# EAGLE design FanTimer (EAGLE 6.3)
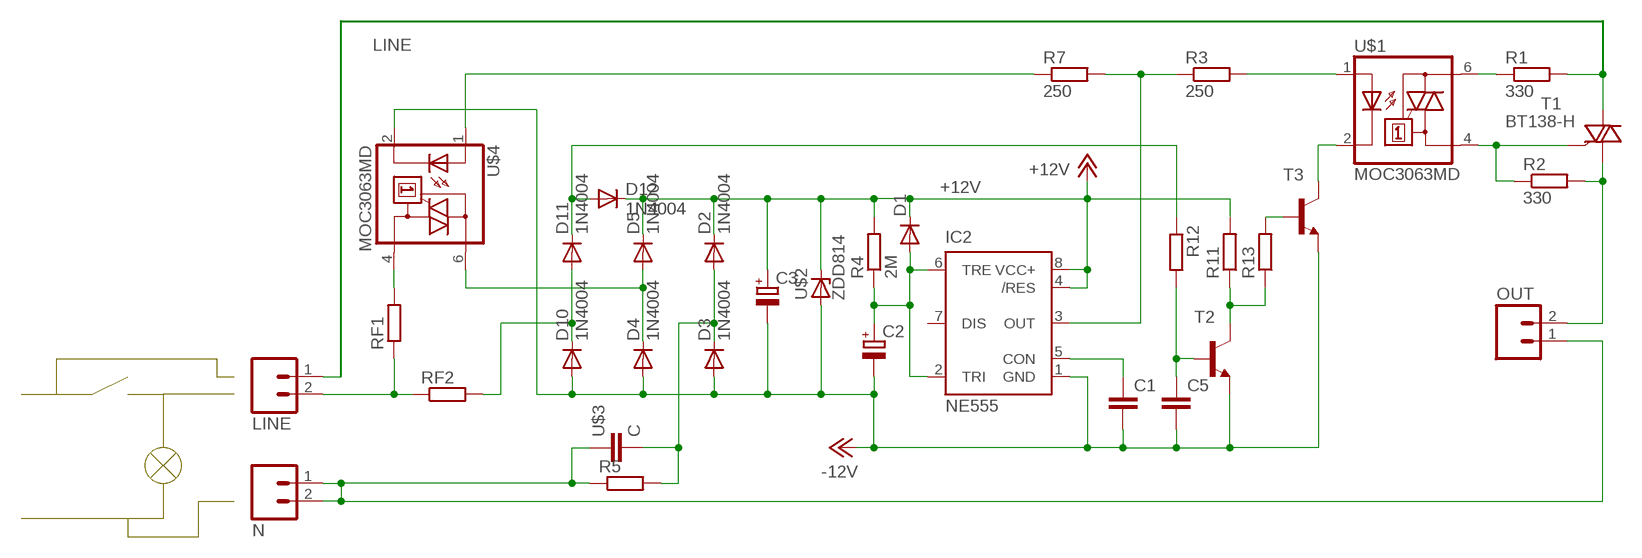
[diagram p0: schematic, sheet 1]

## Parts
C1  C-EU050-025X075  [C050-025X075]
C2  CPOL-EUE2.5-7  [E2,5-7]
C3  CPOL-EUE2.5-7  [E2,5-7]
C5  C-EUC0805  [C0805]
D1  DIODE-SOD80C  [SOD80C]
D2  1N4004  [DO41-10]
D3  1N4004  [DO41-10]
D4  1N4004  [DO41-10]
D5  1N4004  [DO41-10]
D10  1N4004  [DO41-10]
D11  1N4004  [DO41-10]
D12  1N4004  [DO41-10]
IC2  NE555  [DIL-08]
LINE  CON_2P  [CON_PWR_2PIN4MM]
N  CON_2P  [CON_PWR_2PIN4MM]
OUT  CON_2P  [CON_PWR_2PIN4MM]
R1  330  R-EU_0207/10  [0207/10]
R2  330  R-EU_0207/10  [0207/10]
R3  250  R-EU_0207/10  [0207/10]
R4  2M  R-EU_0207/10  [0207/10]
R5  R-EU_0411/12  [0411/12]
R7  250  R-EU_0207/10  [0207/10]
R11  R-EU_0207/10  [0207/10]
R12  R-EU_0207/10  [0207/10]
R13  R-EU_0207/10  [0207/10]
RF1  R-EU_R1206  [R1206]
RF2  R-EU_R1206  [R1206]
T1  BT138-H  [TO220BH]
T2  -NPN-TO92-ECB  [TO92-ECB]
T3  -NPN-TO92-ECB  [TO92-ECB]
U$1  MOC3063MD  [DIL6]
U$2  ZDD814  [ZDMETAL]
U$3  C  [C_22X10]
U$4  MOC3063MD  [DIL6]

## Nets
+12V: C3.+ D1.C D2.C D5.C D12.C IC2.4(/RES) IC2.8(VCC+) R4.2 R11.2 U$2.C
-12V: C1.2 C2.- C3.- C5.2 D3.A D4.A D10.A IC2.1(GND) T2.E T3.E U$2.A U$4.2(C)
LINE: LINE.1 R1.2 T1.T2(A2)
N$1: D4.C D5.A U$4.6(A2)
N$2: RF1.2 U$4.4(A1)
N$3: C1.1 IC2.5(CON)
N$4: R7.1 U$4.1(A)
N$5: R2.1 T1.G U$1.4(A1)
N$6: R1.1 U$1.6(A2)
N$7: D11.C D12.A R12.1
N$8: C2.+ D1.A IC2.2(TRI) IC2.6(TRE) R4.1
N$9: OUT.2 R2.2 T1.T1(A1)
N$12: IC2.3(OUT) R3.1 R7.2
N$13: R3.2 U$1.1(A)
N$14: R11.1 R13.1 T2.C
N$18: LINE.2 RF1.1 RF2.1
N$20: D2.A D3.C R5.2 U$3.2
N$23: R13.2 T3.B
N$24: N.1 N.2 OUT.1 R5.1 U$3.1
N$26: C5.1 R12.2 T2.B
N$28: T3.C U$1.2(C)
SWITCH: D10.C D11.A RF2.2
Unconnected: IC2.7(DIS)

## Library data of the parts
C1 C5 = rcl:C-EU: CAPACITOR, European symbol
C2 C3 = rcl:CPOL-EU: POLARIZED CAPACITOR, European symbol
D1 = diode:DIODE-: DIODE
D2-D5 D10-D12 = diode:1N4004: DIODE general purpose rectifier, 1 A
IC2 = st-microelectronics:NE555: General purpose bipolar Timer; MF: Arrow Electronics; MPN: NE555N; OC_FARNELL: 1467742; OC_NEWARK: 89K1486
LINE N OUT = DSS0:CON_2P
R1-R5 R7 R11-R13 RF1 RF2 = rcl:R-EU_: RESISTOR, European symbol
T1 = triac:BT138: TRIAC Source: http://www.semiconductors.philips.com BT138_SERIES_2.pdf
T2 T3 = transistor:*-NPN-: NPN Transistror BF959 corrected 2008.03.06
U$1 U$4 = DSS0:MOC3063M
U$2 = DSS0:ZD
U$3 = DSS0:C

## Board
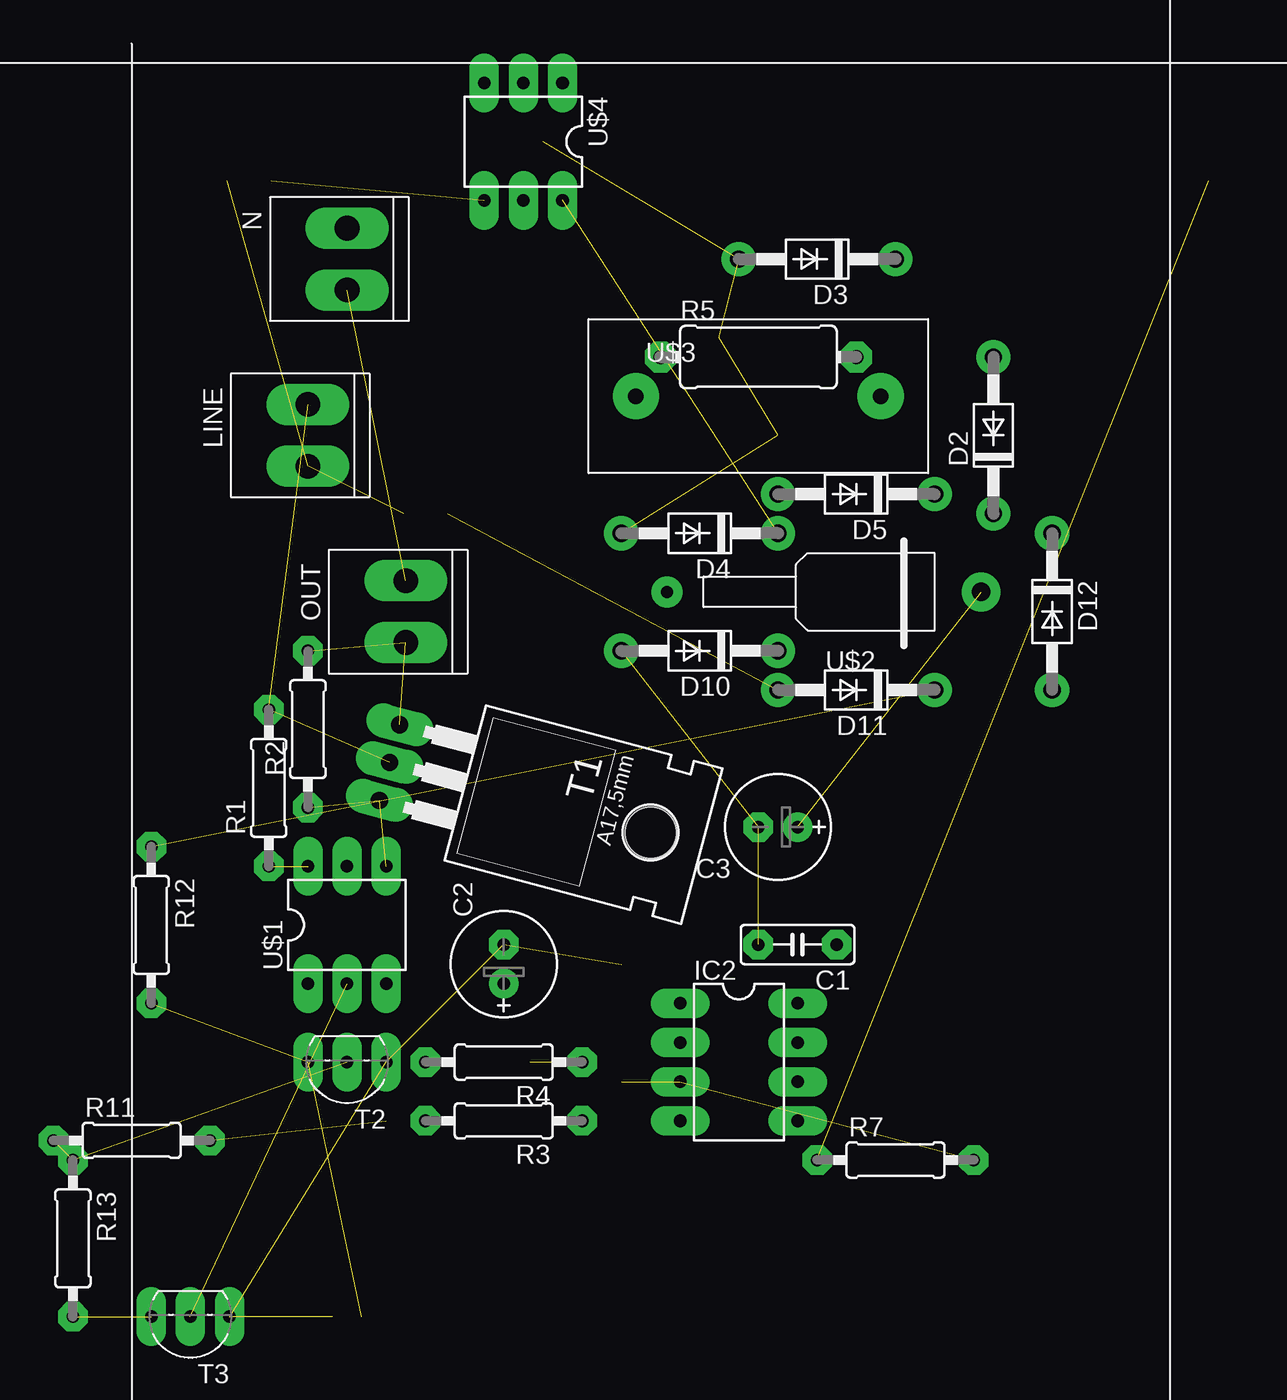
[diagram p1: board, top side]
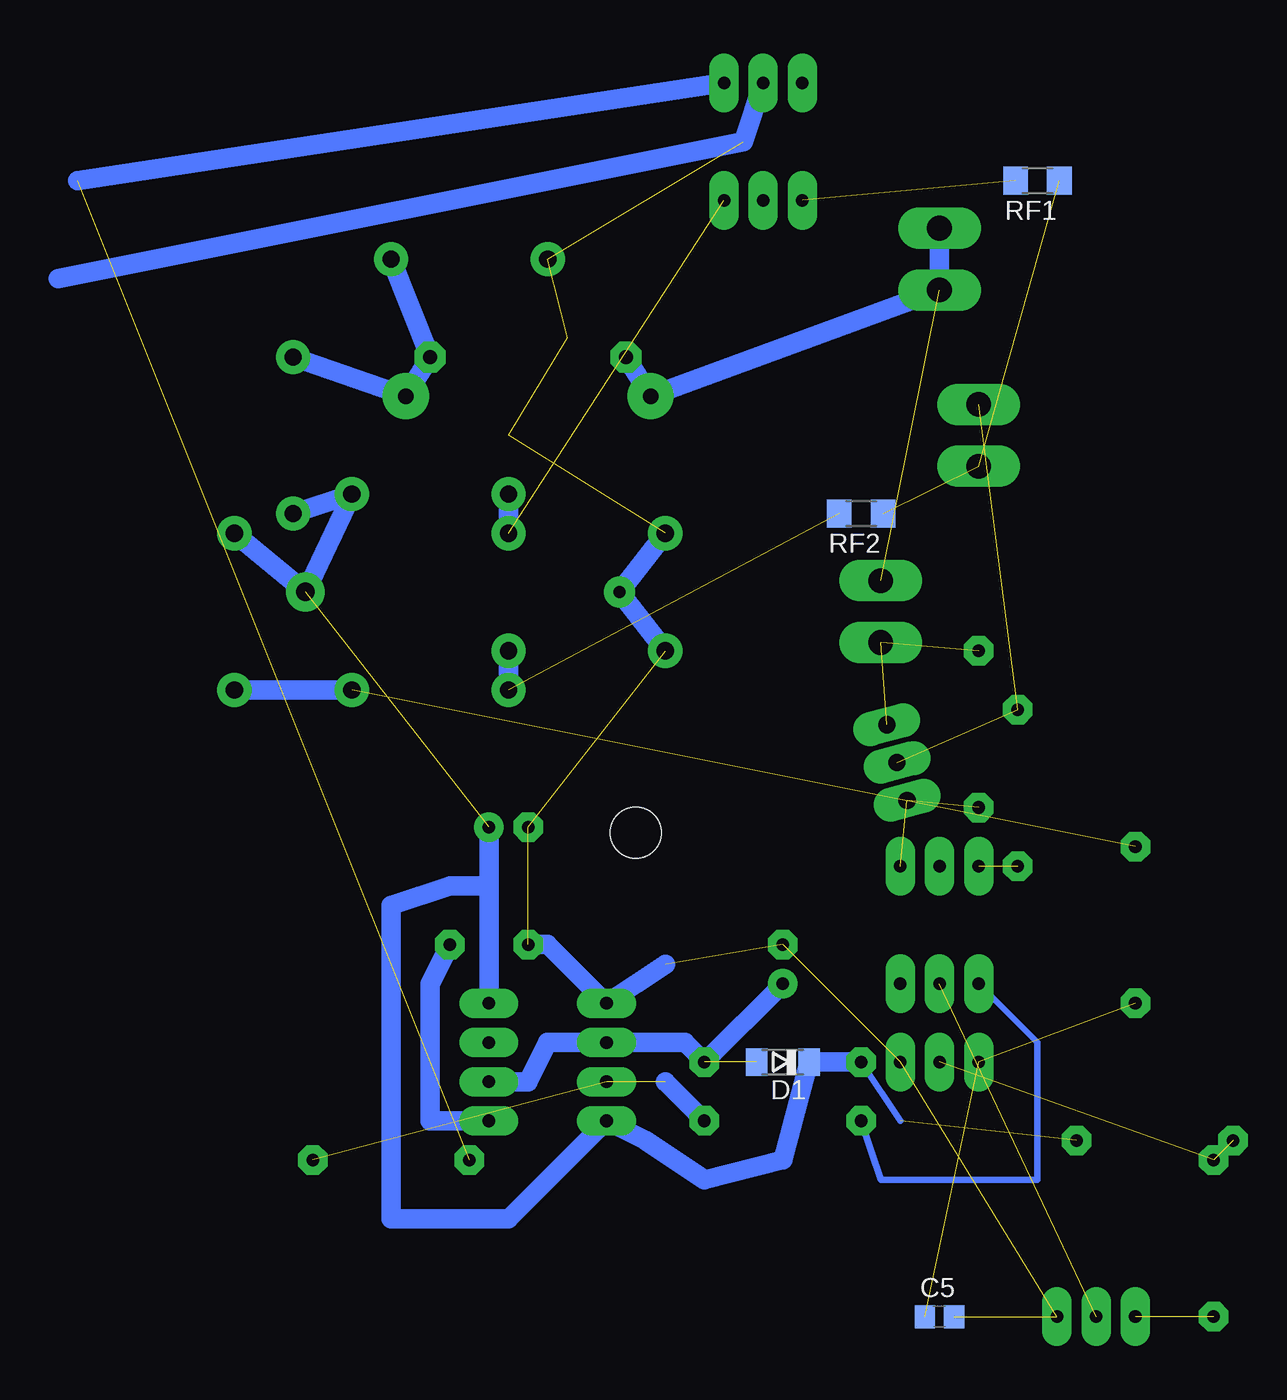
[diagram p2: board, bottom side, seen from below]

No outline drawn. Coordinates in mm, seen from the top.
Copper layers (1*16): Top 0.035mm / dielectric 1.5mm / Bottom 0.035mm
Design rules "DesignRules": minimum track width 8mil, minimum drill 24mil, track to track 0.2mm, track to pad 0.2mm, pad to pad 8mil, via to via 8mil, smd to smd 8mil, copper to edge 10mil, drill to drill 8mil, minimum pad ring 0.55mm, minimum via ring 8mil, stop-mask expansion 4mil, vias tented up to drill 0mil, thermal gap 10mil

### Footprints (pad centres in the part's own frame; a part is rotated, then mirrored left to right if it is on the bottom)
C050-025X075 = drill 0.813 octagon: 1 -2.54,0; 2 2.54,0
E2,5-7 = drill 0.813 pad 1.6: + -1.27,0 | drill 0.813 pad 1.6 octagon: - 1.27,0
C0805 = smd 1.3 x 1.5: 1 -0.95,0; 2 0.95,0
SOD80C = smd 1.4 x 1.8: A 1.7,0; C -1.7,0
DO41-10 = drill 1.118: A 5.08,0; C -5.08,0
DIL-08 = drill 0.813 long: 1 -3.81,-3.81; 2 -1.27,-3.81; 3 1.27,-3.81; 4 3.81,-3.81; 5 3.81,3.81; 6 1.27,3.81; 7 -1.27,3.81; 8 -3.81,3.81
CON_PWR_2PIN4MM = drill 1.6 long: 1 -2,0; 2 2,0
0207/10 = drill 0.813 octagon: 1 -5.08,0; 2 5.08,0
0411/12 = drill 0.914 octagon: 1 -6.35,0; 2 6.35,0
R1206 = smd 1.6 x 1.803: 1 -1.422,0; 2 1.422,0
TO220BH = drill 1.118 long: G 2.54,-6.35; T1 -2.54,-6.35; T2 0,-6.35 | hole 3.302: 0,11.176
TO92-ECB = drill 0.813 long: B 2.54,0; C 0,0; E -2.54,0
DIL6 = drill 0.813 long: 1 -2.54,-3.81; 2 0,-3.81; 3 2.54,-3.81; 4 2.54,3.81; 5 0,3.81; 6 -2.54,3.81
ZDMETAL = drill 0.8 pad 2: A 12.27,0 | drill 1.2 pad 2.5: C -8.095,0
C_22X10 = drill 1 pad 3: 1 -7.938,0; 2 7.938,0

### Placement (x,y rotation side)
C1  104.14,38.1 180 top
C2  85.09,36.83 90 top
C3  102.87,45.72 180 top
C5  74.93,13.97 0 bottom
D1  85.09,30.48 180 bottom
D2  116.84,71.12 90 top
D3  105.41,82.55 180 top
D4  97.79,64.77 180 top
D5  107.95,67.31 180 top
D10  97.79,57.15 180 top
D11  107.95,54.61 180 top
D12  120.65,59.69 270 top
IC2  100.33,30.48 270 top
LINE  72.39,71.12 270 top
N  74.93,82.55 270 top
OUT  78.74,59.69 270 top
R1  69.85,48.26 90 top
R2  72.39,52.07 90 top
R3  85.09,26.67 180 top
R4  85.09,30.48 180 top
R5  101.6,76.2 0 top
R7  110.49,24.13 0 top
R11  60.96,25.4 0 top
R12  62.23,39.37 270 top
R13  57.15,19.05 270 top
RF1  68.58,87.63 180 bottom
RF2  80.01,66.04 180 bottom
T1  83.82,48.26 255 top
T2  74.93,30.48 180 top
T3  64.77,13.97 180 top
U$1  74.93,39.37 0 top
U$2  107.95,60.96 180 top
U$3  101.6,73.66 0 top
U$4  86.36,90.17 180 top

### Tracks (layer width: path | path; a pad name or v marks a point on that pad's centre or on a via)
+12V  (2 unrouted)
  Bottom 0.406: 77.47,26.67 R4.2
  Bottom 1.27: 104.14,41.91 106.68,41.91 110.49,40.64 110.49,20.32 102.87,20.32 IC2.4 93.98,25.4 90.17,22.86 85.09,24.13 D1.C R4.2 | 104.14,41.91 IC2.8 | C3.+ 104.14,41.91 | D2.C D5.C U$2.C D12.C
-12V  (10 unrouted)
  Bottom 1.27: C1.2 100.33,38.1 IC2.1 92.71,36.83 | U$4.2 87.63,90.17 132.08,81.28 | D4.A U$2.A D10.A
LINE  (2 unrouted)
N$1  (1 unrouted)
  Bottom 1.27: D4.C D5.A
N$2  (1 unrouted)
N$3
  Bottom 1.27: C1.1 107.95,35.56 107.95,26.67 IC2.5
N$4  (1 unrouted)
  Bottom 1.27: U$4.1 130.81,87.63
N$5  (2 unrouted)
N$6  (1 unrouted)
N$7  (1 unrouted)
  Bottom 1.27: D11.C D12.A
N$8  (1 unrouted)
  Bottom 1.27: IC2.6 101.6,29.21 100.33,31.75 IC2.2 91.44,31.75 R4.1 C2.+
N$9  (2 unrouted)
N$12  (2 unrouted)
  Bottom 1.27: 92.71,29.21 R3.1
N$13
  Bottom 0.406: R3.2 78.74,22.86 68.58,22.86 68.58,31.75 U$1.1
N$14  (2 unrouted)
N$18  (2 unrouted)
N$20
  Bottom 1.27: D2.A U$3.2 R5.2 D3.C
N$23  (1 unrouted)
N$24  (1 unrouted)
  Bottom 1.27: R5.1 U$3.1 N.2 N.1
N$26  (2 unrouted)
N$28  (1 unrouted)
SWITCH  (1 unrouted)
  Bottom 1.27: D10.C D11.A